# Altium schematic sheet Programmer.SchDoc
size A4; SheetNumber: 4; SheetTotal: 5
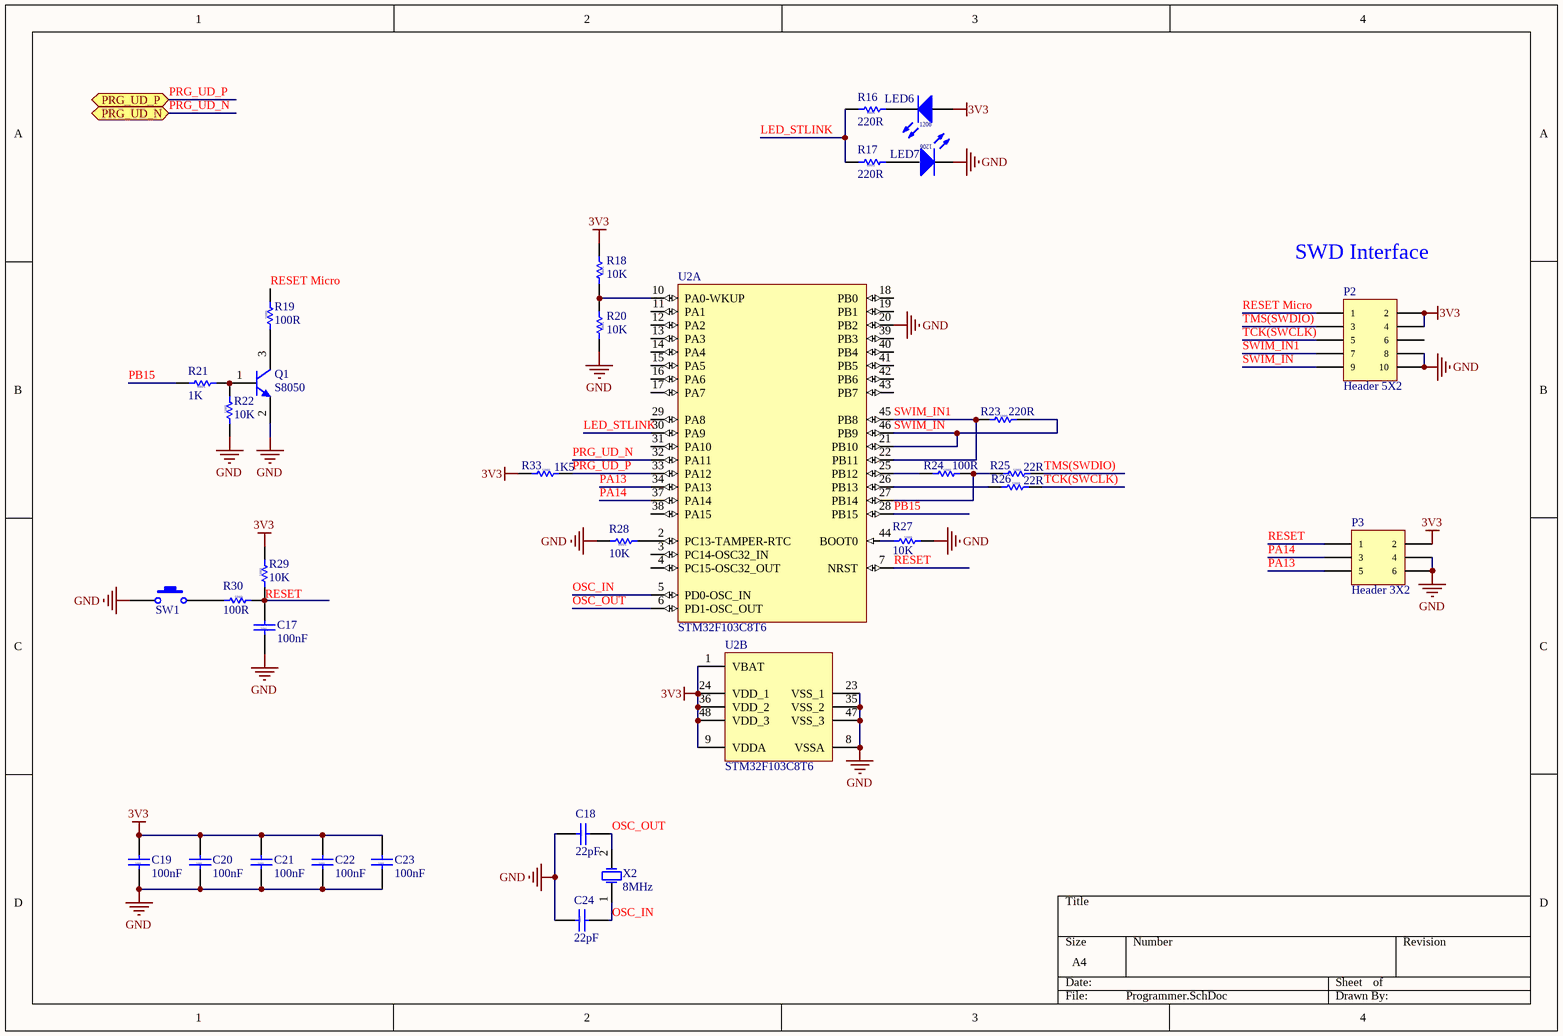
[diagram p0: Programmer.SchDoc]

## Parts
C17  100nF  [RES 0805]
C18  22pF  [RES 0805]
C19  100nF  [RES 0805]
C20  100nF  [RES 0805]
C21  100nF  [RES 0805]
C22  100nF  [RES 0805]
C23  100nF  [RES 0805]
C24  22pF  [RES 0805]
LED6  LED 1206  [LED 1206]  (value not drawn)
LED7  LED 1206  [LED 1206]  (value not drawn)
P2  Header 5X2  [HDR2X5]
P3  Header 3X2  [HDR2X3]
Q1  S8050  [SOT-23]
R16  220R  [RES 0805]
R17  220R  [RES 0805]
R18  10K  [RES 0805]
R19  100R  [RES 0805]
R20  10K  [RES 0805]
R21  1K  [RES 0805]
R22  10K  [RES 0805]
R23  220R  [RES 0805]
R24  100R  [RES 0805]
R25  22R  [RES 0805]
R26  22R  [RES 0805]
R27  10K  [RES 0805]
R28  10K  [RES 0805]
R29  10K  [RES 0805]
R30  100R  [RES 0805]
R33  1K5  [RES 0805]
SW1  Pushing Switch  [micro sch]  (value not drawn)
U2  STM32F103C8T6  [STM-LQFP48_N]  (parts A,B of 2)
X2  8MHz  [XTAL - SMD]

## Ports
PRG_UD_N (bidir), PRG_UD_P (bidir)

## Nets
3V3: C19.2 C20.2 C21.2 C22.2 C23.2 LED6.1(A) P2.2 P2.4 P3.2 R18.1 R29.2 R33.1 U2.1(VBAT) U2.9(VDDA) U2.24(VDD_1) U2.36(VDD_2) U2.48(VDD_3)
GND: C17.1 C18.1 C19.1 C20.1 C21.1 C22.1 C23.1 C24.1 LED7.2(K) P2.8 P2.10 P3.4 P3.6 Q1.2(E) R20.2 R22.1 R27.2 R28.2 SW1.1 U2.8(VSSA) U2.20(PB2) U2.23(VSS_1) U2.35(VSS_2) U2.47(VSS_3)
LED_STLINK: R16.2 R17.2 U2.30(PA9)
OSC_IN: C24.2 U2.5(PD0-OSC_IN) X2.1(OSC1)
OSC_OUT: C18.2 U2.6(PD1-OSC_OUT) X2.2(OSC2)
PA13: P3.5 U2.34(PA13)
PA14: P3.3 U2.37(PA14)
PB15: R21.2 U2.28(PB15)
PRG_UD_N: U2.32(PA11) ; port PRG_UD_N
PRG_UD_P: R33.2 U2.33(PA12) ; port PRG_UD_P
RESET: C17.2 P3.1 R29.1 R30.2 U2.7(NRST)
RESET Micro: P2.1 R19.2
SWIM_IN: P2.9 R23.2 U2.21(PB10) U2.46(PB9)
SWIM_IN1: P2.7 R23.1 U2.22(PB11) U2.45(PB8)
TCK(SWCLK): P2.5 R26.2
TMS(SWDIO): P2.3 R25.2
NetLED6_2: LED6.2(K) R16.1
NetLED7_1: LED7.1(A) R17.1
NetQ1_1: Q1.1(B) R21.1 R22.2
NetQ1_3: Q1.3(C) R19.1
NetR18_2: R18.2 R20.1 U2.10(PA0-WKUP)
NetR24_1: R24.1 U2.25(PB12)
NetR24_2: R24.2 R25.1 U2.27(PB14)
NetR26_1: R26.1 U2.26(PB13)
NetR27_1: R27.1 U2.44(BOOT0)
NetR28_1: R28.1 U2.2(PC13-TAMPER-RTC)
NetR30_1: R30.1 SW1.2

Not connected (* = marked no-connect by the designer): P2 6; U2 3(PC14-OSC32_IN) 4(PC15-OSC32_OUT) 11(PA1) 12(PA2) 13(PA3) 14(PA4) 15(PA5) 16(PA6) 17(PA7) 18(PB0) 19(PB1) 29(PA8) 31(PA10) 38(PA15) 39(PB3) 40(PB4) 41(PB5) 42(PB6) 43(PB7)

## Notes on the sheet
- (near P2) SWD Interface
- (in symbol CAP 0805) 0805
- (in symbol LED 1206) 1206
- (in symbol RES 0805) 0805

## Library data of the parts
C17-C24 = CAP 0805
P2 = Header 5X2: Header, 5-Pin, Dual row; LatestRevisionDate: 17-Jul-2002; LatestRevisionNote: Re-released for DXP Platform.; Publisher: Altium Limited
P3 = Header 3X2: Header, 3-Pin, Dual row; LatestRevisionDate: 17-Jul-2002; LatestRevisionNote: Re-released for DXP Platform.; Publisher: Altium Limited
Q1 = S8050 SMD
R16-R30 R33 = RES 0805
SW1 = Pushing Switch 2Pin: Published: 24-Mar-1999; LatestRevisionDate: 17-Jul-2002; LatestRevisionNote: Re-released for DXP Platform.; PackageReference: SPST-2; Publisher: Altium Limited
U2 = STM32F103C8T6: ARM Cortex-M3 32-bit MCU, 64 KB Flash, 20 KB Internal RAM, 37 I/Os, 48-pin LQFP, -40 to 85 degC, Tray; A/D Converter: 2x12-bit (10 Channel); FLASH Size (Prog) (kB): 64; I/Os (High Current): 37; Internal RAM Size (kB): 20; Operating Frequency(F) (Processor speed) (MHz): 72; Supply Voltage(Vcc) min (V): 2; DatasheetVersion: Rev. 16; PackageVersion: Rev. 6, 06/2013; PackageReference: LQFP48; PackageDescription: 48-Pin Low Profile Quad Flat Package, 7 x 7 mm Body, 0.5 mm Pitch; Supplier 1: Digi-Key; Supplier Part Number 1: 497-6063-ND; Supplier 2: Farnell; Supplier Part Number 2: 1447637; Supplier 3: Newark; Supplier Part Number 3: 59M2182; Supplier 4: Newark; Supplier Part Number 4: 57P1222; Supplier 5: Mouser; Supplier Part Number 5: 511-STM32F103C8T6; Core: ARM Cortex-M3; Packing: Tray; Mounting Technology: Surface Mount; PartNumber: STM32F103C8T6; ComponentLink1Description: Manufacturer URL; ComponentLink1URL: http://www.st.com/web/en/home.html; ComponentLink2Description: Datasheet; ComponentLink2URL: http://www.st.com/st-web-ui/static/active/en/resource/technical/document/datasheet/CD00161566.pdf; ComponentLink3Description: Package Specification; ComponentLink3URL: http://www.st.com/st-web-ui/static/active/en/resource/technical/document/datasheet/DM00058181.pdf
X2 = XTAL - SMD